# EAGLE design tornado-Backplane (EAGLE 7.6.0)
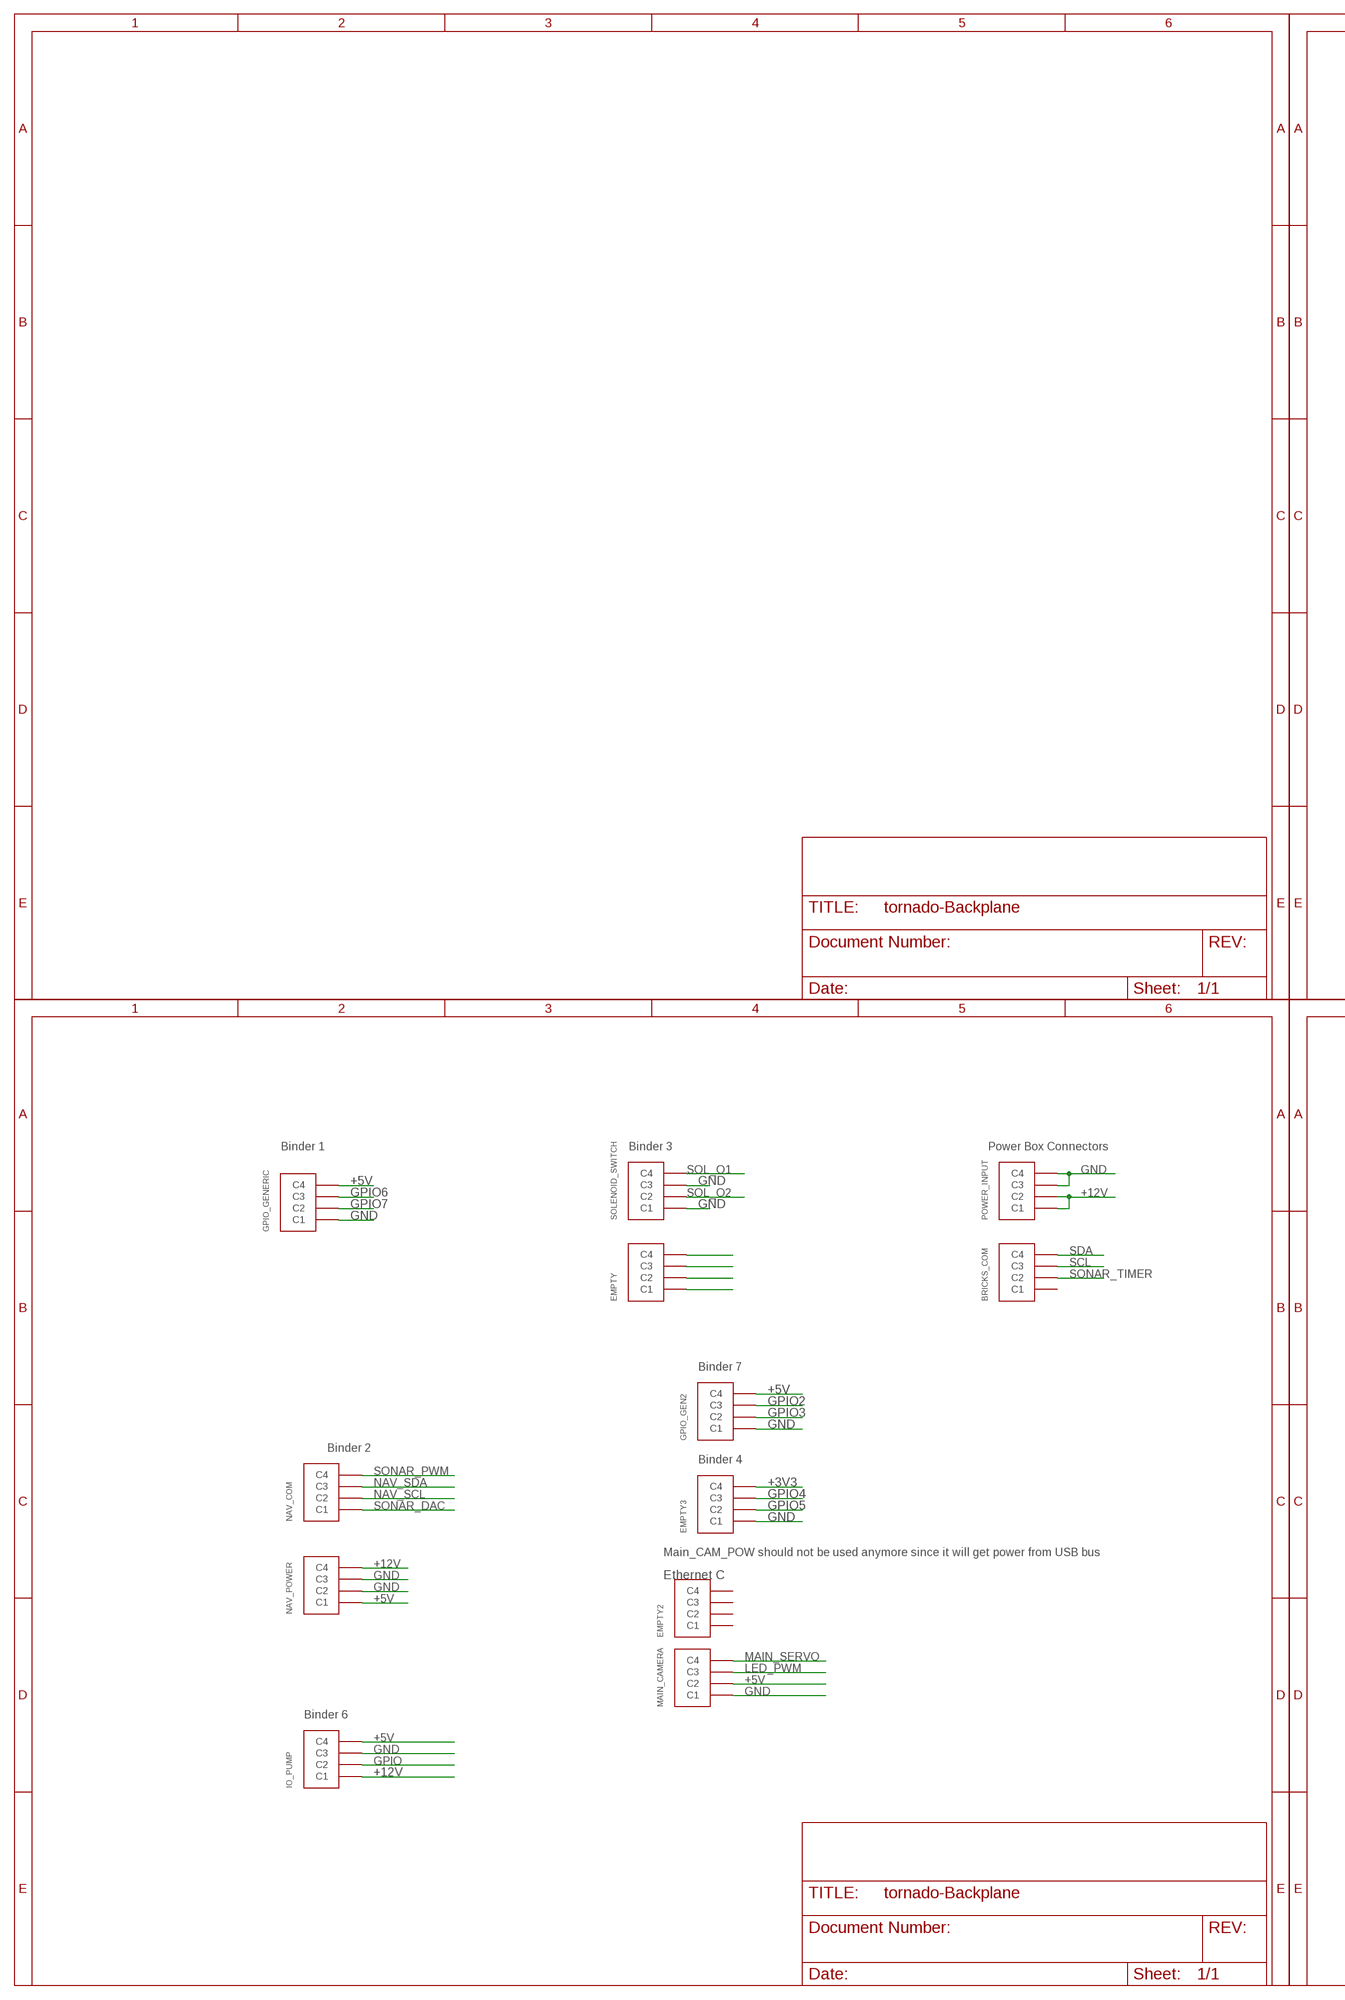
[diagram p0: schematic, sheet 1, part 1 of 2]
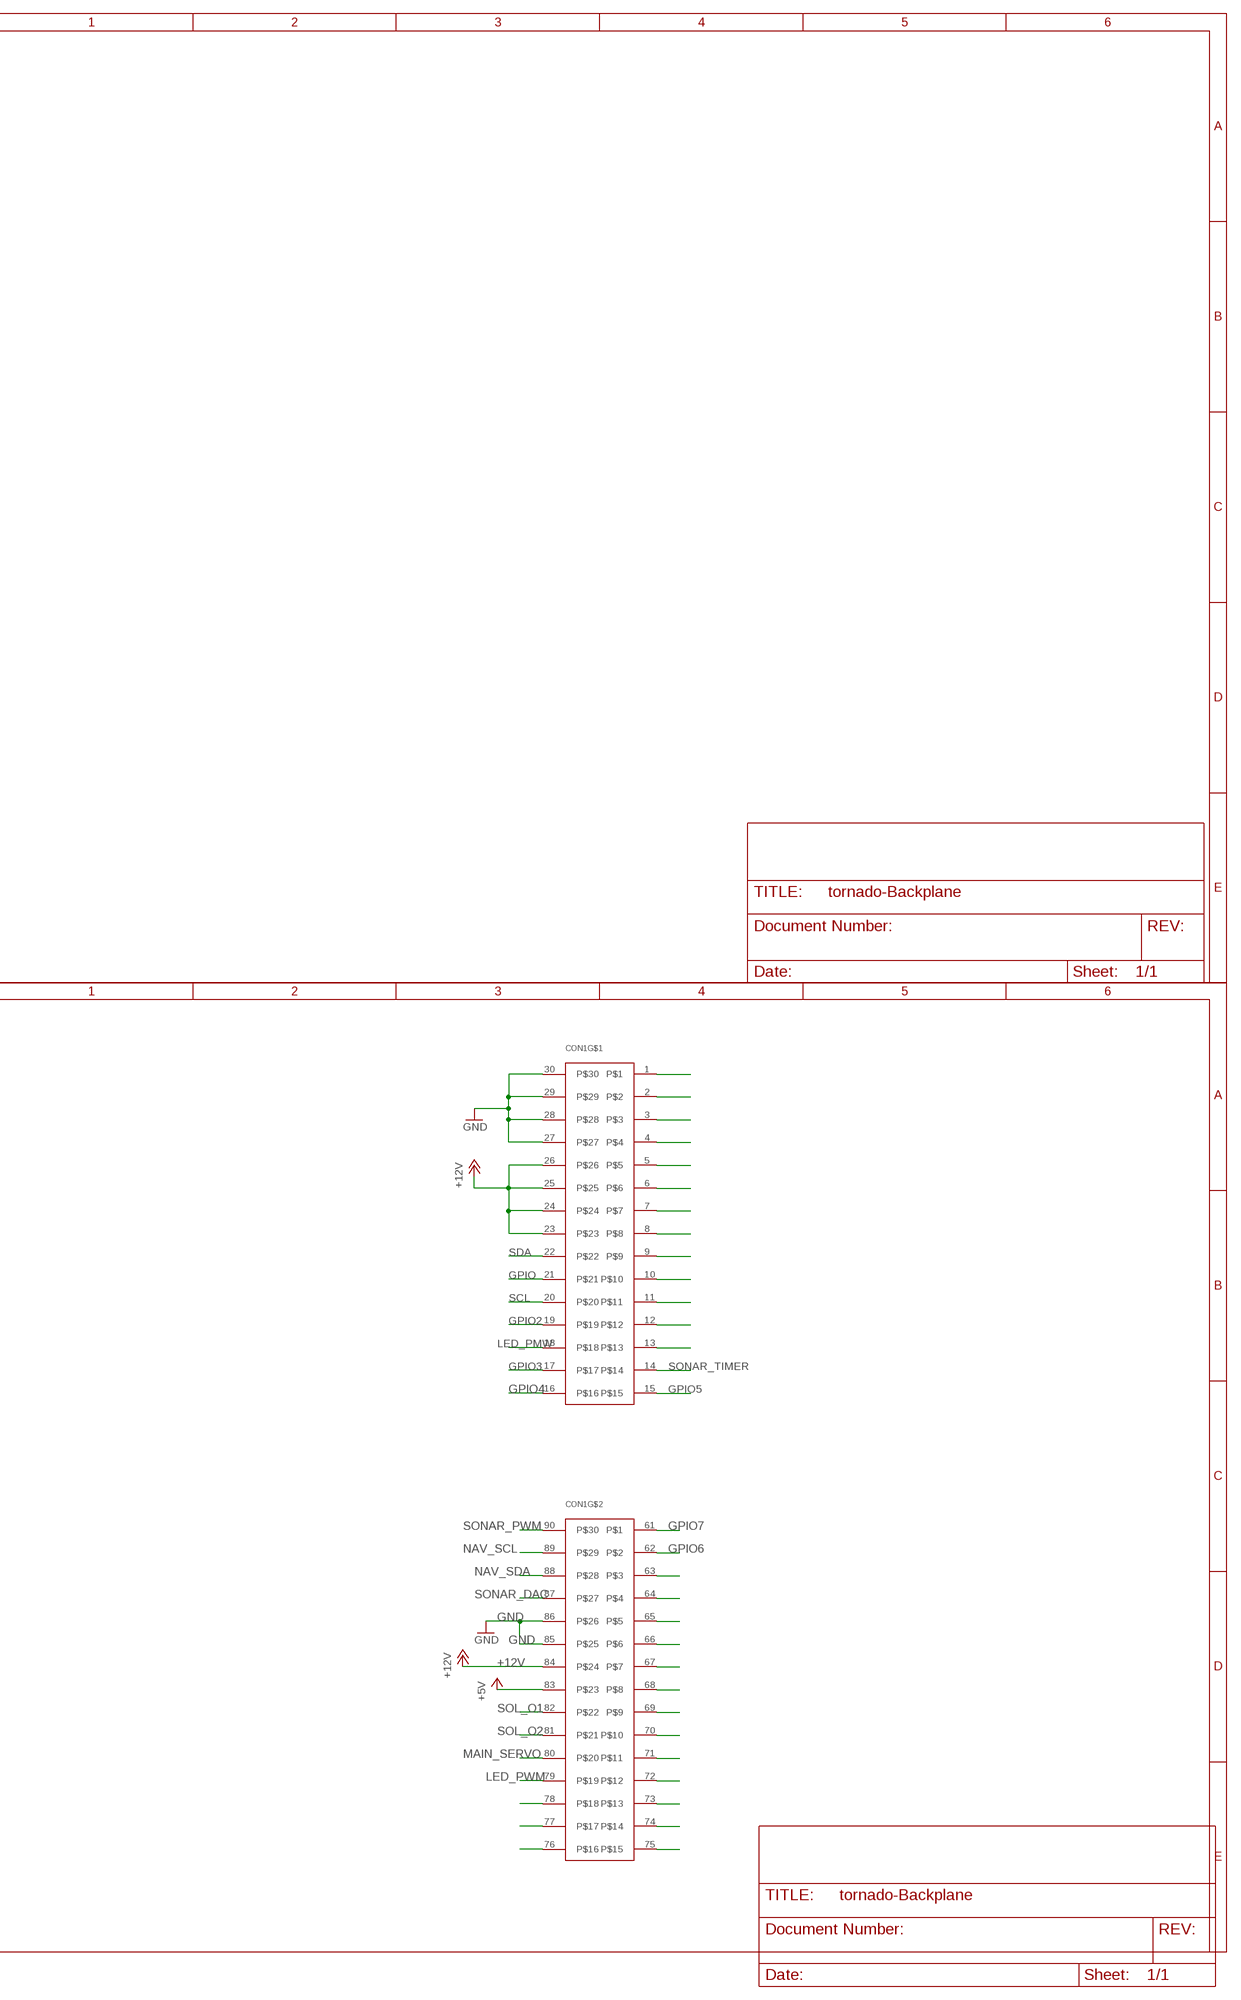
[diagram p1: schematic, sheet 1, part 2 of 2]

## Parts
BRICKS_COM  MICRO-FIT-4-SMD-PART  [MICRO-FIT-4-SMD]
CON1  ROV_SHIELD_V2  [ROV_SHIELD_V2]
EMPTY  MICRO-FIT-4-SMD-PART  [MICRO-FIT-4-SMD]
EMPTY2  MICRO-FIT-4-SMD-PART  [MICRO-FIT-4-SMD]
EMPTY3  MICRO-FIT-4-SMD-PART  [MICRO-FIT-4-SMD]
GPIO_GEN2  MICRO-FIT-4-SMD-PART  [MICRO-FIT-4-SMD]
GPIO_GENERIC  MICRO-FIT-4-SMD-PART  [MICRO-FIT-4-SMD]
IO_PUMP  MICRO-FIT-4-SMD-PART  [MICRO-FIT-4-SMD]
MAIN_CAMERA  MICRO-FIT-4-SMD-PART  [MICRO-FIT-4-SMD]
NAV_COM  MICRO-FIT-4-SMD-PART  [MICRO-FIT-4-SMD]
NAV_POWER  MICRO-FIT-4-SMD-PART  [MICRO-FIT-4-SMD]
POWER_INPUT  MICRO-FIT-4-SMD-PART  [MICRO-FIT-4-SMD]
SOLENOID_SWITCH  MICRO-FIT-4-SMD-PART  [MICRO-FIT-4-SMD]

## Nets
+3V3: EMPTY3.C4
+5V: CON1.83 GPIO_GEN2.C4 GPIO_GENERIC.C4 IO_PUMP.C4 MAIN_CAMERA.C2 NAV_POWER.C1
+12V: CON1.23 CON1.24 CON1.25 CON1.26 CON1.84 IO_PUMP.C1 NAV_POWER.C4 POWER_INPUT.C1 POWER_INPUT.C2
GND: CON1.27 CON1.28 CON1.29 CON1.30 CON1.85 CON1.86 EMPTY3.C1 GPIO_GEN2.C1 GPIO_GENERIC.C1 IO_PUMP.C3 MAIN_CAMERA.C1 NAV_POWER.C2 NAV_POWER.C3 POWER_INPUT.C3 POWER_INPUT.C4 SOLENOID_SWITCH.C1 SOLENOID_SWITCH.C3
GPIO: CON1.21 IO_PUMP.C2
GPIO2: CON1.19 GPIO_GEN2.C3
GPIO3: CON1.17 GPIO_GEN2.C2
GPIO4: CON1.16 EMPTY3.C3
GPIO5: CON1.15 EMPTY3.C2
GPIO6: CON1.62 GPIO_GENERIC.C3
GPIO7: CON1.61 GPIO_GENERIC.C2
KJ: CON1.77
LED_PMW: CON1.18
LED_PWM: CON1.79 MAIN_CAMERA.C3
MAIN_SERVO: CON1.80 MAIN_CAMERA.C4
N$2: EMPTY.C1
N$3: EMPTY.C2
N$4: EMPTY.C3
N$5: EMPTY.C4
N$6: CON1.2
N$7: CON1.1
N$8: CON1.78
N$24: CON1.13
N$25: CON1.12
N$26: CON1.11
N$27: CON1.10
N$28: CON1.9
N$29: CON1.8
N$30: CON1.7
N$31: CON1.6
N$32: CON1.5
N$33: CON1.4
N$34: CON1.3
N$37: CON1.76
N$38: CON1.75
N$39: CON1.74
N$40: CON1.73
N$41: CON1.72
N$42: CON1.71
N$43: CON1.70
N$44: CON1.69
N$45: CON1.68
N$46: CON1.67
N$47: CON1.66
N$48: CON1.65
N$49: CON1.64
N$50: CON1.63
NAV_SCL: CON1.89 NAV_COM.C2
NAV_SDA: CON1.88 NAV_COM.C3
SCL: BRICKS_COM.C3 CON1.20
SDA: BRICKS_COM.C4 CON1.22
SOL_O1: CON1.82 SOLENOID_SWITCH.C4
SOL_O2: CON1.81 SOLENOID_SWITCH.C2
SONAR_DAC: CON1.87 NAV_COM.C1
SONAR_PWM: CON1.90 NAV_COM.C4
SONAR_TIMER: BRICKS_COM.C2 CON1.14
Unconnected: BRICKS_COM.C1 EMPTY2.C1 EMPTY2.C2 EMPTY2.C3 EMPTY2.C4

## Notes on the sheet
- Binder 1 | Binder 3 | Power Box Connectors
- Binder 7
- Binder 2
- Binder 4
- Main_CAM_POW should not be used anymore since it will get power from USB bus
- Ethernet C
- Binder 6

## Library data of the parts
BRICKS_COM EMPTY EMPTY2 EMPTY3 GPIO_GEN2 GPIO_GENERIC IO_PUMP MAIN_CAMERA NAV_COM NAV_POWER POWER_INPUT SOLENOID_SWITCH = Connectors:MICRO-FIT-4-SMD: 4 Pin Molex connector; DIGIKEY-CONTACT-PN: WM1125CT-ND; DIGIKEY-FEMALE-PN: WM2640CT-ND; DIGIKEY-MALE-PN: WM1847-ND
CON1 = rovconnectors:ROV_SHIELD_V2

## Board
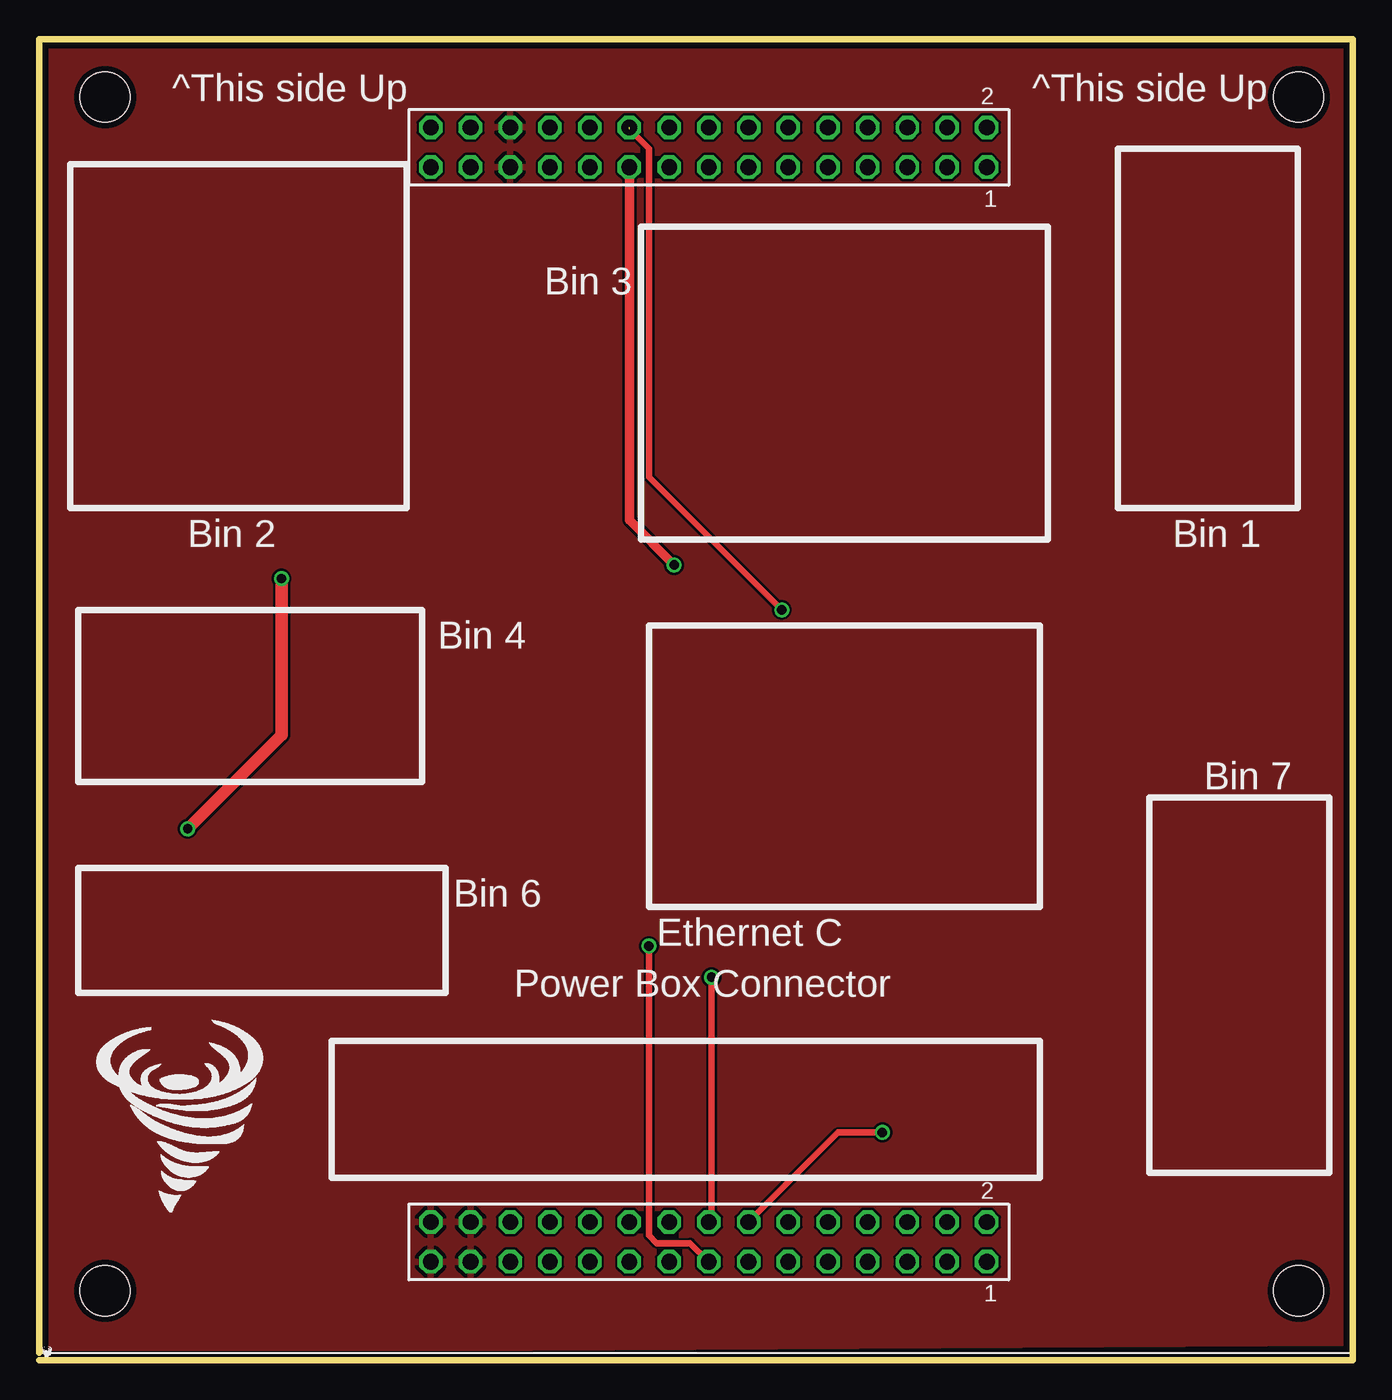
[diagram p2: board, top side]
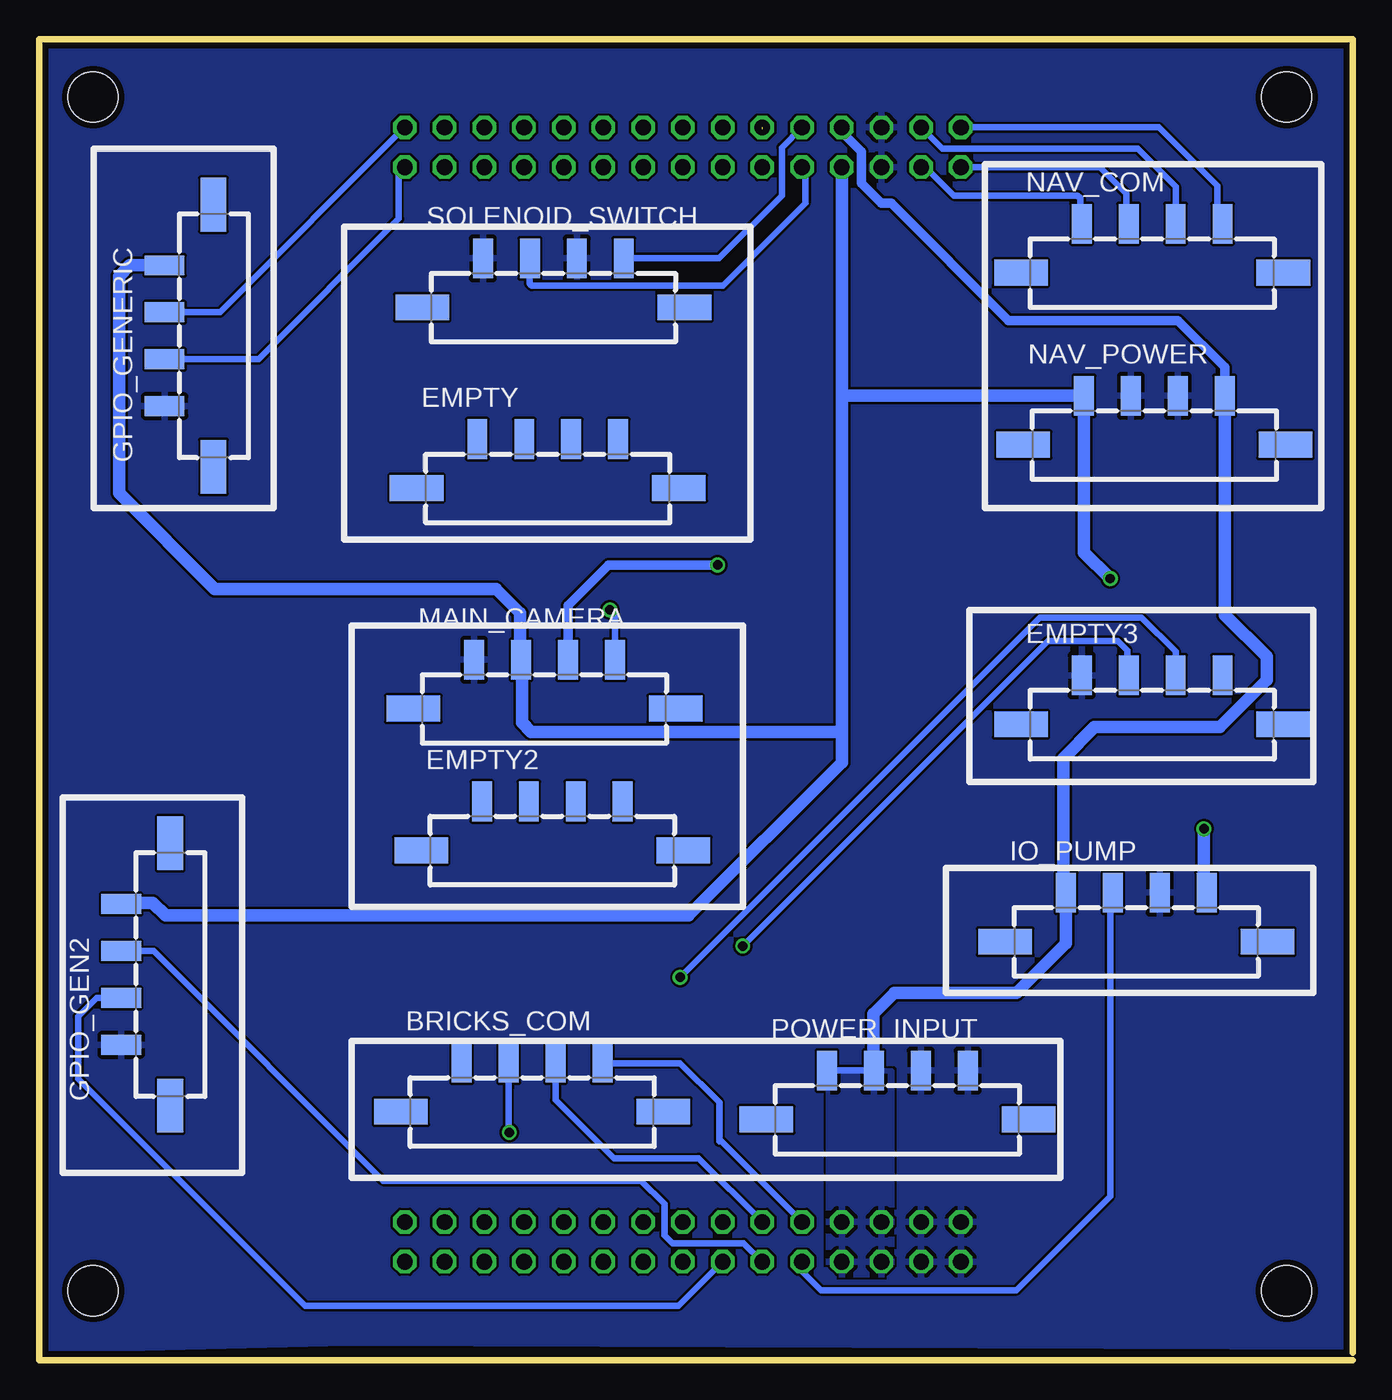
[diagram p3: board, bottom side, seen from below]

Size 84 x 84.5 mm. Coordinates in mm from the lower left corner, seen from the top.
Outline: 0,0 84,0 84,84.5 0,84.5 0,0.5
Copper layers (1*16): Top 0.0356mm / dielectric 1.5011mm / Bottom 0.0356mm
Design rules "PCBs_io": minimum track width 6mil, minimum drill 13mil, track to track 6mil, track to pad 6mil, pad to pad 6mil, via to via 6mil, smd to smd 6mil, copper to edge 15mil, drill to drill 6mil, minimum pad ring 7mil, minimum via ring 7mil, stop-mask expansion 3mil, vias tented up to drill 0mil, thermal gap 10mil

### Footprints (pad centres in the part's own frame; a part is rotated, then mirrored left to right if it is on the bottom)
MICRO-FIT-4-SMD = smd 1.27 x 2.54: C1 5.6,3.955; C2 8.6,3.955; C3 11.6,3.955; C4 14.6,3.955 | smd 3.43 x 1.65: NC1 1.715,0.825; NC2 18.485,0.825
ROV_SHIELD_V2 = drill 1 pad 1.5 octagon: 1 60.61,5.81; 2 60.61,8.35; 3 58.07,5.81; 4 58.07,8.35; 5 55.53,5.81; 6 55.53,8.35; 7 52.99,5.81; 8 52.99,8.35; 9 50.45,5.81; 10 50.45,8.35; 11 47.91,5.81; 12 47.91,8.35; 13 45.37,5.81; 14 45.37,8.35; 15 42.83,5.81; 16 42.83,8.35; 17 40.29,5.81; 18 40.29,8.35; 19 37.75,5.81; 20 37.75,8.35; 21 35.21,5.81; 22 35.21,8.35; 23 32.67,5.81; 24 32.67,8.35; 25 30.13,5.81; 26 30.13,8.35; 27 27.59,5.81; 28 27.59,8.35; 29 25.05,5.81; 30 25.05,8.35; 61 60.61,75.81; 62 60.61,78.35; 63 58.07,75.81; 64 58.07,78.35; 65 55.53,75.81; 66 55.53,78.35; 67 52.99,75.81; 68 52.99,78.35; 69 50.45,75.81; 70 50.45,78.35; 71 47.91,75.81; 72 47.91,78.35; 73 45.37,75.81; 74 45.37,78.35; 75 42.83,75.81; 76 42.83,78.35; 77 40.29,75.81; 78 40.29,78.35; 79 37.75,75.81; 80 37.75,78.35; 81 35.21,75.81; 82 35.21,78.35; 83 32.67,75.81; 84 32.67,78.35; 85 30.13,75.81; 86 30.13,78.35; 87 27.59,75.81; 88 27.59,78.35; 89 25.05,75.81; 90 25.05,78.35 | hole 3.2: 4.215,80.288; 4.215,3.955; 80.547,3.955; 80.547,80.288

### Placement (x,y rotation side)
BRICKS_COM  62.57,15.08 0 bottom
CON1  0,0.5 0 top
EMPTY  61.57,54.96 0 bottom
EMPTY2  61.28,31.8 0 bottom
EMPTY3  22.92,39.86 0 bottom
GPIO_GEN2  74.8,14.58 90 bottom
GPIO_GENERIC  72.02,55.43 90 bottom
IO_PUMP  23.93,25.96 0 bottom
MAIN_CAMERA  61.78,40.86 0 bottom
NAV_COM  22.92,68.73 0 bottom
NAV_POWER  22.78,57.73 0 bottom
POWER_INPUT  39.21,14.58 0 bottom
SOLENOID_SWITCH  61.21,66.52 0 bottom

### Tracks (layer width: path | path; a pad name or v marks a point on that pad's centre or on a via)
+5V  (via drill 0.6)
  Top 0.813: v15.5,50 15.5,40 v9.5,34
  Bottom 0.406: MAIN_CAMERA.C2 53,44.63 53.13,44.51 | 9.5,30.08 IO_PUMP.C4
  Bottom 0.813: CON1.83 32.67,61.69 | v15.5,50 17.18,51.68 NAV_POWER.C1 32.67,61.69 | v9.5,34 9.5,30.08 | 53.22,44.85 MAIN_CAMERA.C2 | 32.67,61.69 32.67,40.13 | 32.67,40.13 32.67,38.24 42.46,28.45 75.9,28.45 76.72,29.27 78.67,29.27 GPIO_GEN2.C4 | 53.13,44.51 53.13,44.27 | 53.13,44.27 53.13,40.8 52.52,40.2 32.74,40.2 32.67,40.13 | GPIO_GENERIC.C4 78.2,70.03 78.89,69.34 78.89,55.46 72.77,49.34 54.78,49.34 53.23,47.79 53.23,44.38 53.13,44.27
+12V
  Bottom 0.406: 18.5,30.08 IO_PUMP.C1 | POWER_INPUT.C1 POWER_INPUT.C2 30.64,18.54
  Bottom 0.61: NAV_POWER.C4 8.18,63.51 11.17,66.5 22,66.5 29.5,74 30.12,74 31.41,75.29 31.41,77.29 32.67,78.55 CON1.84
  Bottom 0.813: CON1.84 32.67,78.67 | NAV_POWER.C4 8.18,47.68 5.5,45 5.5,43.5 8.5,40.5 16.5,40.5 18.5,38.5 18.5,30.08 | IO_PUMP.C1 18.33,26.67 21.5,23.5 29.31,23.5 30.64,22.17 30.64,18.54
  pour Bottom: 29.5,5.5 33.5,5.5 33.5,18.5 29.5,18.5
GND
  pour Bottom (rank 6): 47.31,84.3 83.6,84.3 83.75,0.63 64.25,1.13 -0.19,0.87 0.24,84.23
  pour Top (rank 6): 0.35,84.3 84.17,83.98 83.75,1.13 0.25,0.63
GPIO
  Bottom 0.406: CON1.21 35.21,5.71 34,4.5 21.5,4.5 15.5,10.5 15.5,29.75 IO_PUMP.C2
GPIO2
  Bottom 0.406: GPIO_GEN2.C3 76.68,26.18 62,11.5 45.5,11.5 44,10 44,8 43.5,7.5 38.94,7.5 CON1.19
GPIO3
  Bottom 0.406: GPIO_GEN2.C2 80.32,23.18 81.5,22 81.5,18 67,3.5 43.1,3.5 CON1.17
GPIO4  (via drill 0.6)
  Top 0.406: v43,24.5 43,9.02 CON1.16
  Bottom 0.406: EMPTY3.C3 11.32,45.32 13.5,47.5 20,47.5 v43,24.5
GPIO5  (via drill 0.6)
  Top 0.406: v39,26.5 39,8 39.5,7.5 41.64,7.5 CON1.15
  Bottom 0.406: EMPTY3.C2 14.32,44.82 14.42,44.92 14.42,45.41 15.01,46 19.5,46 v39,26.5
GPIO6
  Bottom 0.406: GPIO_GENERIC.C3 72.43,67.03 CON1.62
GPIO7
  Bottom 0.406: GPIO_GENERIC.C2 69.97,64.03 61,73 61,75.92 CON1.61
LED_PWM  (via drill 0.6)
  Top 0.61: CON1.79 37.75,53.73 v40.61,50.87
  Bottom 0.61: v40.61,50.87 47.58,50.87 50.17,48.27 MAIN_CAMERA.C3
MAIN_SERVO  (via drill 0.6)  (1 unrouted)
  Top 0.406: 37.75,78.75 39,77.5 39,56.5 v47.5,48
  Bottom 0.406: MAIN_CAMERA.C4 47.18,47.68 v47.5,48
NAV_SCL
  Bottom 0.406: CON1.89 16.16,76.31 14.46,74.61 14.46,73.51 14.5,73.47 14.5,72.87 NAV_COM.C2
NAV_SDA
  Bottom 0.406: NAV_COM.C3 11.32,73.31 | 11.32,73.31 11.32,73.82 | CON1.88 26.24,77.5 13.74,77.5 11.31,75.07 11.31,73.32 11.32,73.31
SCL
  Bottom 0.406: BRICKS_COM.C3 50.97,16.65 47.24,12.93 41.83,12.93 CON1.20
SDA
  Bottom 0.406: CON1.22 40.36,14 40.5,14 40.5,16.5 43,19 47.93,19 BRICKS_COM.C4
SOL_O1
  Bottom 0.406: CON1.82 36.5,77.56 36.5,74.5 40.52,70.48 SOLENOID_SWITCH.C4
SOL_O2
  Bottom 0.406: CON1.81 35,76.1 35,74 40.27,68.73 52.5,68.73 52.65,68.88 52.65,70.44 SOLENOID_SWITCH.C2 | 52.61,70.11 SOLENOID_SWITCH.C2 | 52.61,70.33 SOLENOID_SWITCH.C2
SONAR_DAC
  Bottom 0.406: CON1.87 27.31,76.31 25.5,74.5 17.59,74.5 17.42,74.34 17.42,72.79 NAV_COM.C1
SONAR_PWM
  Bottom 0.406: CON1.90 12.39,78.85 8.66,75.12 8.66,73.03 NAV_COM.C4
SONAR_TIMER  (via drill 0.6)
  Top 0.406: CON1.14 51.1,14.58 v53.93,14.58
  Bottom 0.406: BRICKS_COM.C2 53.97,18.55 53.97,17.45 53.97,14.62 v53.93,14.58

### Text on the board
tPlace: ^This side Up | ^This side Up | /home/sample/tornado-clip-art-9TRb5XqTe.bmp | /home/sample/tornado-clip-art-9TRb5XqTe.bmp
tNames: Bin 3 | Bin 2 | Bin 1 | Bin 4 | Bin 7 | Bin 6 | Ethernet C | Power Box Connector
tValues: Board made by Sam Deghuee / and Flor Albornoz, / with help from Matt Molo / Purdue ROV 2016